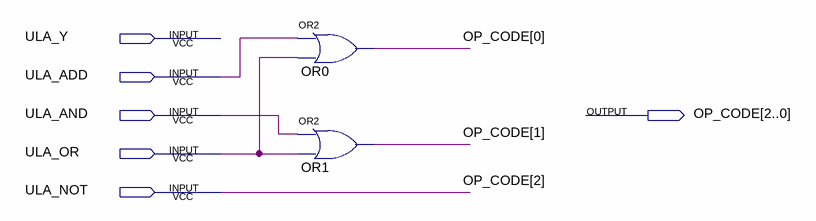
[diagram p0: schematic sheet]
// Quartus schematic COD_ULA.bdf as structural Verilog: 2 symbols, 6 pins
module COD_ULA (
  input  ULA_Y,
  input  ULA_ADD,
  input  ULA_AND,
  input  ULA_OR,
  input  ULA_NOT,
  output [2:0] OP_CODE
);

  or OR0 (OP_CODE[0], ULA_ADD, ULA_OR);
  or OR1 (OP_CODE[1], ULA_AND, ULA_OR);

  assign OP_CODE[2] = ULA_NOT;
endmodule
